# Altium schematic sheet Servo Header.SchDoc: Servo Connections
size B; Date: 24-02-02; CheckedBy: Jude Thibeault; Engineer: Kyle Dick; Revision: 2; SheetNumber: 7; SheetTotal: 9
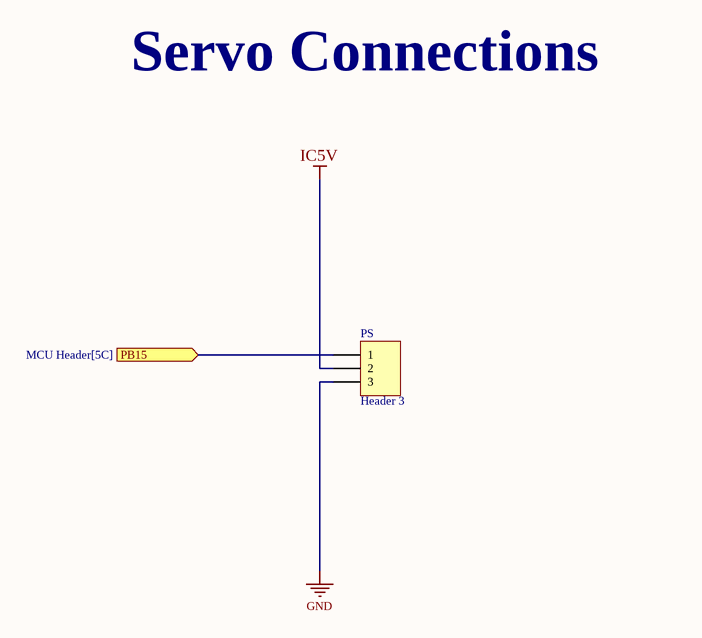
[diagram p0: Servo Header.SchDoc]

## Parts
PS  Header 3  [HDR1X3]

## Ports
PB15 (in, see MCU Header[5C])

## Nets
GND: PS.3
IC5V: PS.2
PB15: PS.1 ; port PB15

## Notes on the sheet
- Servo Connections
- ESE
- is the sole property of ESE. Any reproduction
- The Information Contained in this drawing
- Schematic P/N and Name
- Sheet Name
- 850 Fountain St. S.
- Cambridge, ON N3H 0A8
- Canada
- Approved
- in part or in whole without the written
- permission of ESE is strictly prohibited.
- APPROVALS
- DATE
- Size
- Scale
- B
- NTS
- Bare PCB P/N
- Date
- Sheet
- Rev.
- Checked
- Created
- of

## Library data of the parts
PS = Header 3: Header, 3-Pin Male; MPN: PEC03SFAN; PN: S1212E-03-ND; URL: http://www.digikey.ca/product-detail/en/PEC03SFAN/S1212E-03-ND